# Altium schematic sheet Arduino connectors.SchDoc
size A4
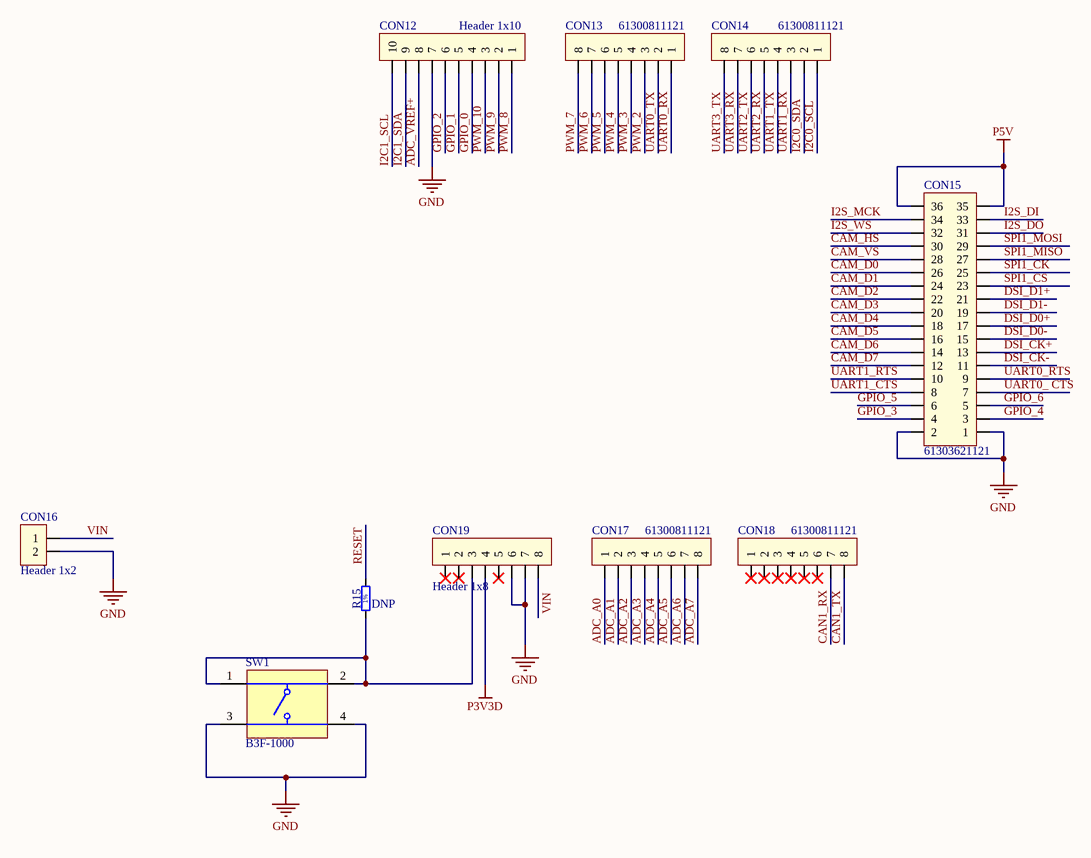
[diagram p0: Arduino connectors.SchDoc]

## Parts
CON12  Header 1x10  [61301011121]
CON13  61300811121  [61300811121]
CON14  61300811121  [61300811121]
CON15  61303621121  [61303621121]
CON16  Header 1x2  [61300211121]
CON17  61300811121  [61300811121]
CON18  61300811121  [61300811121]
CON19  Header 1x8  [61300811121]
R15  value DNP  [R0603]  (hidden comment: 1041)
SW1  B3F-1000  [OMRON-B3F-1000-4_V]

## Nets
GND: CON12.7 CON15.1 CON15.2 CON16.2 CON19.6 CON19.7 SW1.3 SW1.4
P3V3D: CON19.4
P5V: CON15.35 CON15.36
ADC_A0: CON17.1
ADC_A1: CON17.2
ADC_A2: CON17.3
ADC_A3: CON17.4
ADC_A4: CON17.5
ADC_A5: CON17.6
ADC_A6: CON17.7
ADC_A7: CON17.8
ADC_VREF+: CON12.8
CAM_D0: CON15.26
CAM_D1: CON15.24
CAM_D2: CON15.22
CAM_D3: CON15.20
CAM_D4: CON15.18
CAM_D5: CON15.16
CAM_D6: CON15.14
CAM_D7: CON15.12
CAM_HS: CON15.30
CAM_VS: CON15.28
CAN1_RX: CON18.7
CAN1_TX: CON18.8
DSI_CK+: CON15.13
DSI_CK-: CON15.11
DSI_D0+: CON15.17
DSI_D0-: CON15.15
DSI_D1+: CON15.21
DSI_D1-: CON15.19
GPIO_0: CON12.4
GPIO_1: CON12.5
GPIO_2: CON12.6
GPIO_3: CON15.4
GPIO_4: CON15.3
GPIO_5: CON15.6
GPIO_6: CON15.5
I2C0_SCL: CON14.1
I2C0_SDA: CON14.2
I2C1_SCL: CON12.10
I2C1_SDA: CON12.9
I2S_DI: CON15.33
I2S_DO: CON15.31
I2S_MCK: CON15.34
I2S_WS: CON15.32
PWM_2: CON13.3
PWM_3: CON13.4
PWM_4: CON13.5
PWM_5: CON13.6
PWM_6: CON13.7
PWM_7: CON13.8
PWM_8: CON12.1
PWM_9: CON12.2
PWM_10: CON12.3
RESET: R15.2
SPI1_CK: CON15.25
SPI1_CS: CON15.23
SPI1_MISO: CON15.27
SPI1_MOSI: CON15.29
UART0_ CTS: CON15.7
UART0_RTS: CON15.9
UART0_RX: CON13.1
UART0_TX: CON13.2
UART1_CTS: CON15.8
UART1_RTS: CON15.10
UART1_RX: CON14.3
UART1_TX: CON14.4
UART2_RX: CON14.5
UART2_TX: CON14.6
UART3_RX: CON14.7
UART3_TX: CON14.8
VIN: CON16.1 CON19.8
NetCON19_3: CON19.3 R15.1 SW1.1 SW1.2

Not connected (* = marked no-connect by the designer): CON18 1* 2* 3* 4* 5* 6*; CON19 1* 2* 5*

## Notes on the sheet
- Title:
- Size:
- Date:
- A4
- Author:
- Revision:
- Sheet
- of
- DME-Projects
- Mannestraat 77
- 2440 Geel
- info@dme-projects.be
- Project:
- © DME-projects 2020
- (in symbol CMP-209-1038-1) 1%

## Library data of the parts
CON12 = CMP-00035-4: WURTH ELEKTRONIK - 61301011121 - Pin Header, Board-to-Board, 2.54 mm, 1 Rows, 10 Contacts, Through Hole, WR-PHD Series; Gender: Male; Voltage Rating: 250V; Number of Contacts: 10; Insulation Resistance: 1GR; Connector Type: Male Pin; Pitch: 2.54mm; Current Rating: 3A; REACH SVHC: Unknown; Width: 25.4mm; Contact Type: Male Pin; Max Operating Temperature: 125°C; Contact Material: Copper Alloy,Copper; Height: 11.54mm; Color: Black; Min Operating Temperature: -40°C; Packaging: Bulk; Contact Gender: Male; Mount: Through Hole; Termination: Solder; Series: WR-PHD; Number of Positions: 10; Length: 2.54mm; Orientation: Straight; Contact Mating Length: 0.236inch; Contact Plating: Gold; Package Quantity: 1000; Number of Rows: 1; Flammability Rating: UL94 V-0; Housing Material: PBT
CON13 CON14 CON17 CON18 = CMP-002-00276-1: Board-To-Board Connector, Vertical, Wr-Phd Series, Through Hole, Header, 8, 2.54 Mm; Number of Contacts: 8; Gender: Male; Pitch: 0.1inch; Connector Type: Male Pin; Mount: Through Hole; REACH SVHC: Unknown; Packaging: Bulk; Termination: Solder; Number of Rows: 1; Contact Material: Copper; Color: Black; Contact Mating Length: 0.236inch; Number of Positions: 8; Contact Plating: Gold
CON15 = CMP-002-00281-1: WURTH ELEKTRONIK - 61303621121 - Pin Header, Vertical, Board-to-Board, 2.54 mm, 2 Rows, 36 Contacts, Through Hole Straight; Pitch: 0.1inch; Number of Contacts: 36; Gender: Male; Connector Type: Male Pin; Packaging: Bulk; Color: Black; Mount: Through Hole; Contact Mating Length: 0.236inch; Row Spacing: 0.1inch; Number of Positions: 36; Contact Material: Copper; Termination: Solder; Number of Rows: 2; Contact Plating: Gold; REACH SVHC: Unknown
CON16 = CMP-002-00284-1: Header 1x2 2.54mm
CON19 = CMP-00035-5: WURTH ELEKTRONIK - 61301011121 - Pin Header, Board-to-Board, 2.54 mm, 1 Rows, 10 Contacts, Through Hole, WR-PHD Series; Connector Type: Male Pin; Insulation Resistance: 1GR; Gender: Male; Number of Contacts: 10; Pitch: 2.54mm; Voltage Rating: 250V; Current Rating: 3A; Contact Material: Copper Alloy,Copper; Color: Black; Packaging: Bulk; Housing Material: PBT; Contact Plating: Gold; Series: WR-PHD; Termination: Solder; Contact Gender: Male; REACH SVHC: Unknown; Min Operating Temperature: -40°C; Max Operating Temperature: 125°C; Height: 11.54mm; Flammability Rating: UL94 V-0; Number of Positions: 10; Contact Type: Male Pin; Contact Mating Length: 0.236inch; Mount: Through Hole; Number of Rows: 1; Width: 25.4mm; Orientation: Straight; Length: 2.54mm; Package Quantity: 1000
R15 = CMP-209-1038-1: generic 0603 Thick film resistor; Voltage: 75V; Power: 100mW; MFG no: generic; Type: Thick film; MFG: generic
SW1 = CMP-011-00004-1: Tactile Switch, SPST-NO, 0.05 A, 24 V, -25 to 70 degC, 4-Pin THD, RoHS, Bulk; Manufacturer: Omron Electronic Components; Resistance: 0.1Ohm; Max Current Rating: 50mA; Voltage Rating: 24V; Throw Configuration: SPST; Operating Force: 100gf; Max Contact Resistance: 100mohm; RoHS Compliant: True; Package Description: 4-Pin Through Hole Device, Body 6 x 6 mm; Contact Current Rating: 50mA; Case/Package: B3F-1000; Contact Plating: Gold; Datasheet Version: Jan-15; Datasheet URL: http://www.omron.com/ecb/products/pdf/en-b3f.pdf; Package Reference: B3F-1000; Pins: 4; Package Quantity: 1500; Max Voltage Rating (DC): 24V; Mounting Technology: TH; Voltage Rating (DC): 24V; Min Operating Temperature: -25°C; Max Operating Temperature: 70°C; Current Rating: 50mA; Packaging: Bulk; Manufacturer URL: http://www.omron.com/; Contact Material: Gold